# EAGLE schematic chinmay (EAGLE 9.1.0)
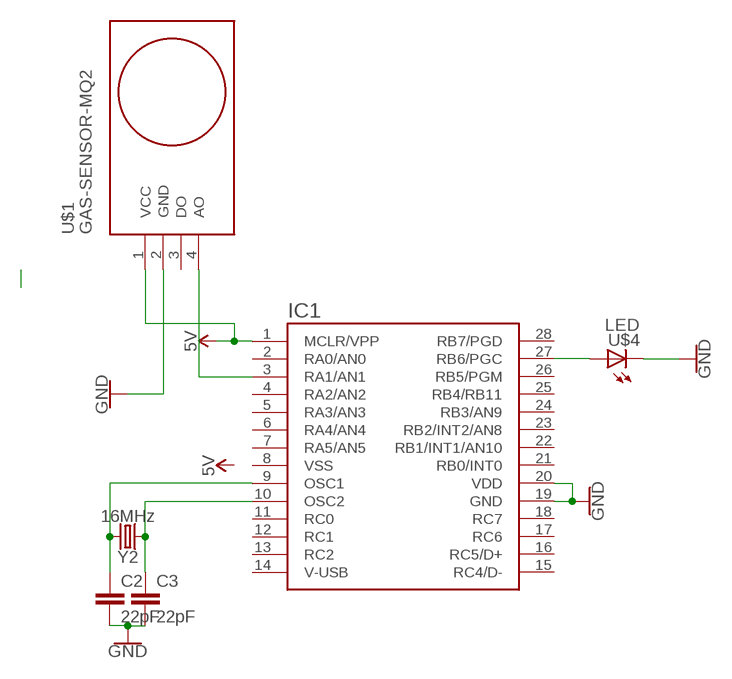
[diagram p0: schematic, sheet 1]

## Parts
C2  22pF  22PF-0603-50V-5%  [0603]
C3  22pF  22PF-0603-50V-5%  [0603]
IC1  PIC18F2550SMD-28  [SO28]
U$1  GAS-SENSOR-MQ2  [GAS-SENSOR-MQ2]
U$4  LED  [HLMP-1790]
Y2  16MHz  CRYSTAL-16MHZPTH-HC49US  [HC49US]

## Nets
5V: IC1.1(MCLR/VPP) U$1.1(VCC)
GND: C2.2 C3.2 IC1.19(GND) IC1.20(VDD) U$1.2(GND) U$4.C
N$2: IC1.3(RA1/AN1) U$1.4(AO)
N$3: IC1.27(RB6/PGC) U$4.A
N$43: C3.1 IC1.10(OSC2) Y2.1
N$45: C2.1 IC1.9(OSC1) Y2.2
Unconnected: IC1.2(RA0/AN0) IC1.4(RA2/AN2) IC1.5(RA3/AN3) IC1.6(RA4/AN4) IC1.7(RA5/AN5) IC1.8(VSS) IC1.11(RC0) IC1.12(RC1) IC1.13(RC2) IC1.14(V-USB) IC1.15(RC4/D-) IC1.16(RC5/D+) IC1.17(RC6) IC1.18(RC7) IC1.21(RB0/INT0) IC1.22(RB1/INT1/AN10) IC1.23(RB2/INT2/AN8) IC1.24(RB3/AN9) IC1.25(RB4/RB11) IC1.26(RB5/PGM) IC1.28(RB7/PGD) U$1.3(DO)

## Library data of the parts
C2 C3 = SparkFun-Capacitors:22PF: 22pF ceramic capacitors A capacitor is a passive two-terminal electrical component used to store electrical energy temporarily in an electric field.; PROD_ID: CAP-07876
IC1 = pic18f2550:PIC18F2550: PIC18F2550 Richard Myrick T. Arellaga April 2010
U$1 = diy-modules:GAS-SENSOR-MQ2: Gas Sensor based on MQ-2 device Guide describing how to use MQ-2 sensor with Arduino is available here: http://www.instructables.com/id/How-to-use-MQ2-Gas-Sensor-Arduino-Tutorial/ MQ-2 sensor datasheet is available here: http://gas-sensor.ru/pdf/combustible-gas-sensor.pdf Click here to find device on ebay.com <http://www.ebay.com/sch/mq2+sensor+module+smoke>
U$4 = Ava:LED
Y2 = SparkFun-Clocks:CRYSTAL-16MHZ: 16MHz Crystal Digikey Example <http://www.digikey.com/product-search/en?keywords=535-9122-1-ND> Frequency: 16MHz Frequency Stability: ±50ppm Frequency Tolerance: ±20ppm Load Capacitance: 18pF SparkFun Products: Pro Micro -5V/16MHz <https://www.sparkfun.com/products/12640> SparkFun Serial Enabled LCD Kit <https://www.sparkfun.com/products/10097>; PROD_ID: XTAL-08181; SF_ID: COM-00536